# EAGLE schematic GPSClock_Display (EAGLE 6.5.0)
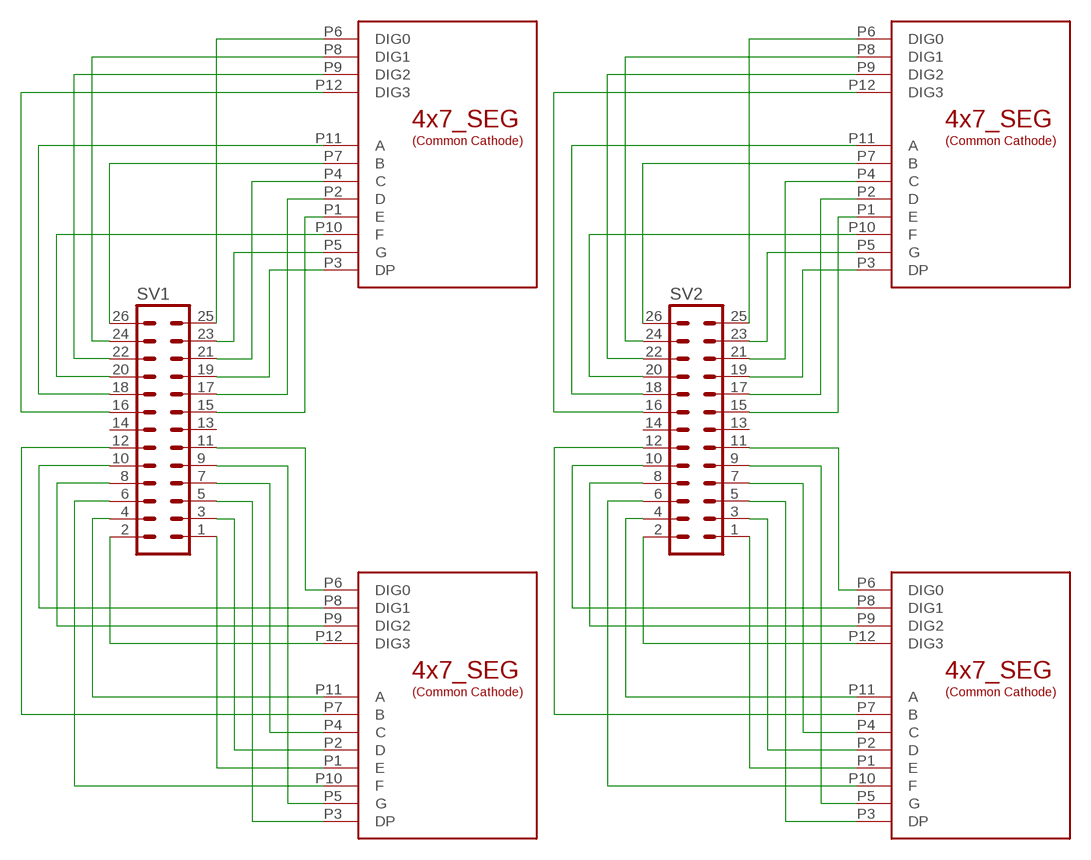
[diagram p0: schematic, sheet 1]

## Parts
SV1  MA13-2  [MA13-2]
SV2  MA13-2  [MA13-2]
U$1  4X7_SEGTHROUGH_HOLE  [4X7_SEG]
U$2  4X7_SEGTHROUGH_HOLE  [4X7_SEG]
U$3  4X7_SEGTHROUGH_HOLE  [4X7_SEG]
U$4  4X7_SEGTHROUGH_HOLE  [4X7_SEG]

## Nets
N$1: SV1.1 U$2.P1(E)
N$2: SV1.3 U$2.P2(D)
N$3: SV1.5 U$2.P3(DP)
N$4: SV1.7 U$2.P4(C)
N$5: SV1.9 U$2.P5(G)
N$6: SV1.11 U$2.P6(DIG0)
N$7: SV1.2 U$2.P12(DIG3)
N$8: SV1.4 U$2.P11(A)
N$9: SV1.6 U$2.P10(F)
N$10: SV1.8 U$2.P9(DIG2)
N$11: SV1.10 U$2.P8(DIG1)
N$12: SV1.12 U$2.P7(B)
N$13: SV1.26 U$1.P7(B)
N$14: SV1.24 U$1.P8(DIG1)
N$15: SV1.22 U$1.P9(DIG2)
N$16: SV1.20 U$1.P10(F)
N$17: SV1.18 U$1.P11(A)
N$18: SV1.16 U$1.P12(DIG3)
N$19: SV1.25 U$1.P6(DIG0)
N$20: SV1.23 U$1.P5(G)
N$21: SV1.21 U$1.P4(C)
N$22: SV1.19 U$1.P3(DP)
N$23: SV1.17 U$1.P2(D)
N$24: SV1.15 U$1.P1(E)
N$25: SV2.1 U$4.P1(E)
N$26: SV2.3 U$4.P2(D)
N$27: SV2.5 U$4.P3(DP)
N$28: SV2.7 U$4.P4(C)
N$29: SV2.9 U$4.P5(G)
N$30: SV2.11 U$4.P6(DIG0)
N$31: SV2.2 U$4.P12(DIG3)
N$32: SV2.4 U$4.P11(A)
N$33: SV2.6 U$4.P10(F)
N$34: SV2.8 U$4.P9(DIG2)
N$35: SV2.10 U$4.P8(DIG1)
N$36: SV2.12 U$4.P7(B)
N$37: SV2.25 U$3.P6(DIG0)
N$38: SV2.23 U$3.P5(G)
N$39: SV2.21 U$3.P4(C)
N$40: SV2.19 U$3.P3(DP)
N$41: SV2.17 U$3.P2(D)
N$42: SV2.15 U$3.P1(E)
N$43: SV2.26 U$3.P7(B)
N$44: SV2.24 U$3.P8(DIG1)
N$45: SV2.22 U$3.P9(DIG2)
N$46: SV2.20 U$3.P10(F)
N$47: SV2.18 U$3.P11(A)
N$48: SV2.16 U$3.P12(DIG3)
Unconnected: SV1.13 SV1.14 SV2.13 SV2.14

## Library data of the parts
SV1 SV2 = con-lstb:MA13-2: PIN HEADER; OC_FARNELL: unknown; OC_NEWARK: unknown
U$1-U$4 = 4x7_SEG:4X7_SEG